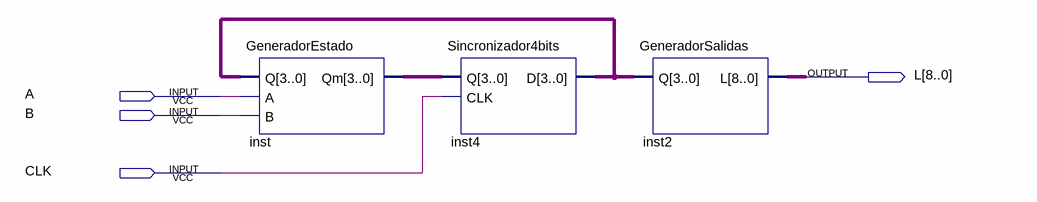
[diagram p0: schematic sheet]
// Quartus schematic MaquinaMoore.bdf as structural Verilog: 3 symbols, 4 pins
module MaquinaMoore (
  input  A,
  input  B,
  input  CLK,
  output [8:0] L
);

  wire [3:0] inst4_d, inst_qm;

  GeneradorEstado inst (.Q(inst4_d), .A(A), .B(B), .Qm(inst_qm));
  Sincronizador4bits inst4 (.Q(inst_qm), .CLK(CLK), .D(inst4_d));
  GeneradorSalidas inst2 (.Q(inst4_d), .L(L));
endmodule
